# Altium schematic sheet POE+POWER+SERVO+CAMERA.SchDoc
size A
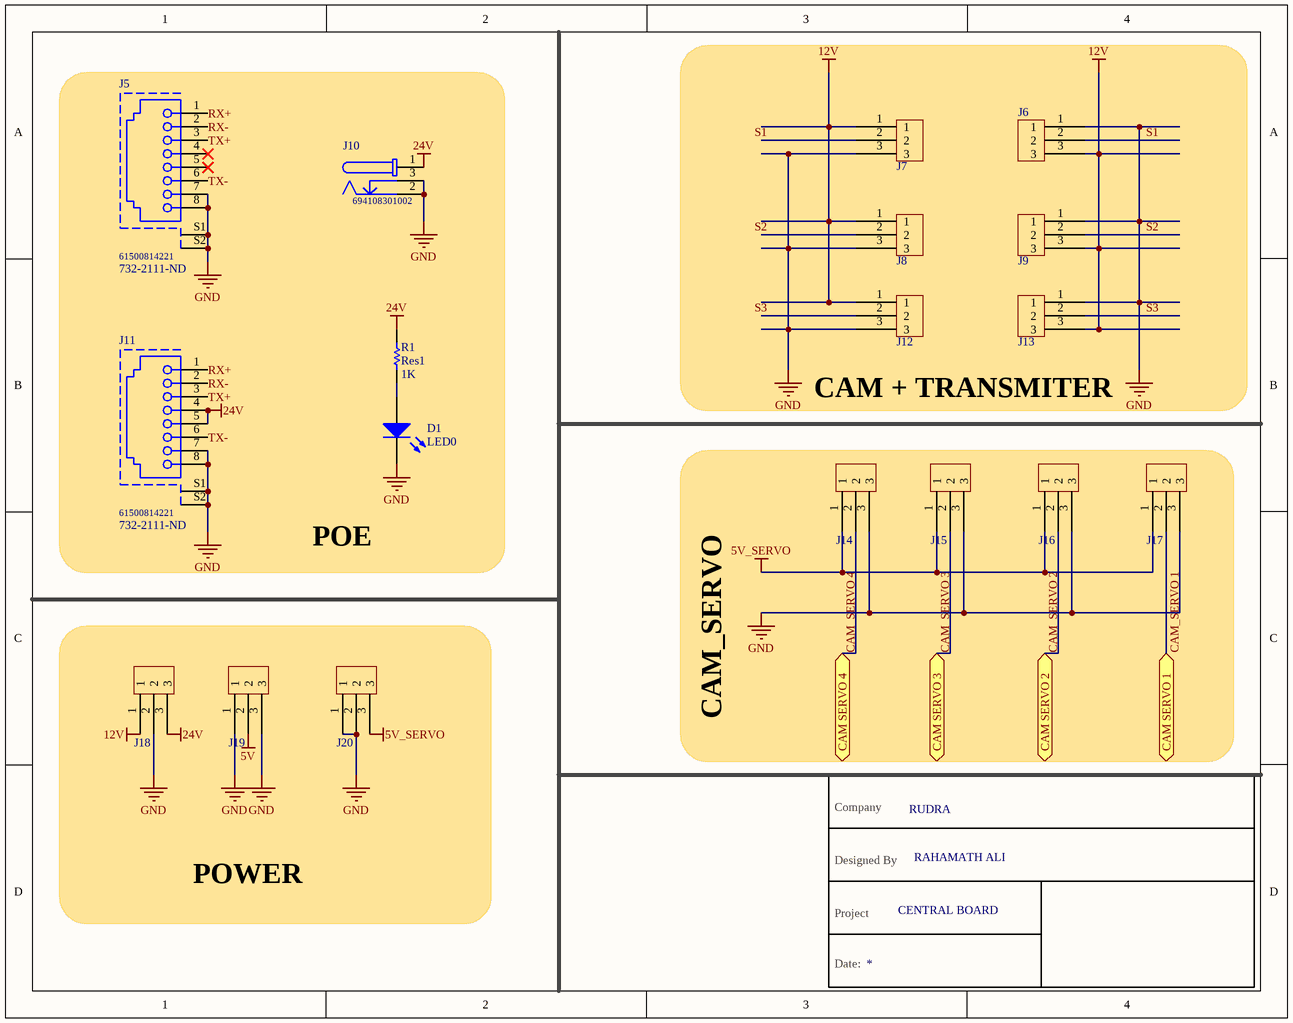
[diagram p0: POE+POWER+SERVO+CAMERA.SchDoc]

## Parts
?  Project: CENTRAL BOARD  Designed By: RAHAMATH ALI  Company: RUDRA  (hidden comment: Schematic Table)  (graphical)
D1  LED0  [LED-0]
J5  61500814221  Supplier Part Number 1: 732-2111-ND  [61500814221]
J6  3 PIN GREEN  [PHOENIX_MSTBA_2,5_3-G-5,08_1757255]  (value not drawn)
J7  3 PIN GREEN  [PHOENIX_MSTBA_2,5_3-G-5,08_1757255]  (value not drawn)
J8  3 PIN GREEN  [PHOENIX_MSTBA_2,5_3-G-5,08_1757255]  (value not drawn)
J9  3 PIN GREEN  [PHOENIX_MSTBA_2,5_3-G-5,08_1757255]  (value not drawn)
J10  694108301002  [694108301002]
J11  61500814221  Supplier Part Number 1: 732-2111-ND  [61500814221]
J12  3 PIN GREEN  [PHOENIX_MSTBA_2,5_3-G-5,08_1757255]  (value not drawn)
J13  3 PIN GREEN  [PHOENIX_MSTBA_2,5_3-G-5,08_1757255]  (value not drawn)
J14  3 PIN GREEN  [PHOENIX_MSTBA_2,5_3-G-5,08_1757255]  (value not drawn)
J15  3 PIN GREEN  [PHOENIX_MSTBA_2,5_3-G-5,08_1757255]  (value not drawn)
J16  3 PIN GREEN  [PHOENIX_MSTBA_2,5_3-G-5,08_1757255]  (value not drawn)
J17  3 PIN GREEN  [PHOENIX_MSTBA_2,5_3-G-5,08_1757255]  (value not drawn)
J18  3 PIN GREEN  [PHOENIX_MSTBA_2,5_3-G-5,08_1757255]  (value not drawn)
J19  3 PIN GREEN  [PHOENIX_MSTBA_2,5_3-G-5,08_1757255]  (value not drawn)
J20  3 PIN GREEN  [PHOENIX_MSTBA_2,5_3-G-5,08_1757255]  (value not drawn)
R1  Res1  value 1K  [AXIAL-0.3]

## Blocks framed on the sheet
POE: D1 J5 J10 J11 R1
CAM + TRANSMITER: J6-J9 J12 J13
CAM_SERVO: J14-J17
POWER: J18-J20

## Ports
CAM SERVO 1 (bidir), CAM SERVO 2 (bidir), CAM SERVO 3 (bidir), CAM SERVO 4 (bidir)

## Nets
5V: J19.2
5V_SERVO: J14.1 J15.1 J16.1 J17.1 J20.3
12V: J6.3 J7.1 J8.1 J9.3 J12.1 J13.3 J18.1
24V: J10.1 J11.4 J11.5 J18.3 R1.2
GND: D1.2(K) J5.7 J5.8 J5.S1 J5.S2 J6.1 J7.3 J8.3 J9.1 J10.2 J10.3 J11.7 J11.8 J11.S1 J11.S2 J12.3 J13.1 J14.3 J15.3 J16.3 J17.3 J18.2 J19.1 J19.3 J20.1 J20.2
CAM_SERVO 1: J17.2 ; port CAM SERVO 1
CAM_SERVO 2: J16.2 ; port CAM SERVO 2
CAM_SERVO 3: J15.2 ; port CAM SERVO 3
CAM_SERVO 4: J14.2 ; port CAM SERVO 4
RX+: J5.1 J11.1
RX-: J5.2 J11.2
S1: J6.2 J7.2
S2: J8.2 J9.2
S3: J12.2 J13.2
TX+: J5.3 J11.3
TX-: J5.6 J11.6
NetD1_1: D1.1(A) R1.1

Not connected (* = marked no-connect by the designer): J5 4* 5*

## Notes on the sheet
- (in symbol Schematic Table) Company; Designed By; Project; Date:

## Library data of the parts
D1 = LED0: Typical INFRARED GaAs LED; Published: 8-Jun-2000; LatestRevisionDate: 08-Jul-2005; LatestRevisionNote: Mech Layer 1 removed.; PackageReference: LED-0; Publisher: Altium Limited; PackageDescription: LED; 2 Leads
J5 J11 = RJ45: Modular Jack WR-MJ, Tab Down, Shielded, Horizontal Entry, THT, 8P8C; Manufacturer: Wurth Elektronik; Manufacturer 1: Wurth Electronics; Withstanding Voltage: 1000VAC; Contact Resistance: 20mOhm; Rated Current: 1.5A; Compliance: Leadfree/RoHS; Port: 1x1; Working Voltage: 120VAC; Connector Type: Jack,RJ45,Socket; Number of Ports: 1; Number of Contacts: 8; Gender: Female; Mating Cycles: 500; Insulation Resistance: 500MR; Voltage Rating (AC): 120V; Entrance: Horizontal; Package Reference: 61500814221; Datasheet URL: https://katalog.we-online.de/em/datasheet/61500814221.pdf; Pin Number: 8P8C; Operating Temperature: -40to85degC; Manufacturer URL: http://www.we-online.de; Packaging: Tray; Publisher: WurthElektronik; Part Number: 61500814221; Mounting Technology: THT; Supplier 1: Digi-Key; Manufacturer Part Number 1: 61500814221; Stock 1: 262; Pricing 1: 1=2.38000, 10=2.33000, 50=2.24000, 100=2.15000, 500=2.06100 (USD); RoHS: Yes; Mount: Through Hole,PCB; Contact Plating: Gold; Contact Material: Copper Alloy,Copper; Housing Material: PBT; Color: Black; Min Operating Temperature: -40°C; Max Operating Temperature: 85°C; Termination: Through Hole; Shielding: Shielded; Number of Positions: 8; Package Quantity: 80; Number of Rows: 1; Direction: Down; Orientation: Right Angle; Current Rating: 1.5A; Length: 13.65mm; Height: 19.95mm; Depth: 21.2mm; Width: 15.88mm; REACH SVHC: Unknown; Flammability Rating: UL94 V-0; ComponentLink1URL: https://datasheet.ciiva.com/1108/76605-1108145.pdf?src-supplier=Element14; ComponentLink1Description: https://datasheet.ciiva.com/1108/76605-1108145.pdf?src-supplier=Element14; ComponentLink2URL: https://datasheet.ciiva.com/4561/61500814221-78459-4561634.pdf?src-supplier=Mouser; ComponentLink2Description: https://datasheet.ciiva.com/4561/61500814221-78459-4561634.pdf?src-supplier=Mouser; ComponentLink3URL: https://datasheet.ciiva.com/686/61500814221-686710.pdf?src-supplier=Digi-Key; ComponentLink3Description: https://datasheet.ciiva.com/686/61500814221-686710.pdf?src-supplier=Digi-Key; ComponentLink4URL: https://datasheet.ciiva.com/11726/0900766b80f88678-11726201.pdf?src-supplier=RSComponents; ComponentLink4Description: https://datasheet.ciiva.com/11726/0900766b80f88678-11726201.pdf?src-supplier=RSComponents; ComponentLink5URL: https://datasheet.ciiva.com/48689/001088220-da-01-en-wr-com-modular-jack-61500814221-48689546.pdf?src-supplier=Conrad; ComponentLink5Description: https://datasheet.ciiva.com/48689/001088220-da-01-en-wr-com-modular-jack-61500814221-48689546.pdf?src-supplier=Conrad
J6-J9 J12-J20 = 3 PIN GREEN: Manufacturer 1: Phoenix Contact; Manufacturer Part Number 1: 1757255; Current Rating: 12A; Voltage Rating: 250V; Voltage Rating (DC): 320V; Number of Poles: 3; Number of Levels: 1; Current: 15A; Voltage: 300V; Connector Type: Plug; Gender: Male; Pitch: 5.08mm; Approvals: UL,CSA,VDE,EN; Supplier 1: Digi-Key; Stock 1: 4025; Pricing 1: 1=1.03000, 10=0.99000, 50=0.94720, 100=0.92130, 250=0.86100, 500=0.79212, 1000=0.73185, 2500=0.69741, 5000=0.65436 (USD); RoHS: Yes; Mount: Through Hole; Weight: 5.396916oz; Color: Grey,Green; Contact Plating: Tin; Housing Color: Green; Housing Material: Polybutylene; Contact Material: Tin; Package Quantity: 50; Packaging: Bulk; Termination: Solder; Max Current Rating: 12A; Number of Rows: 1; Number of Positions: 3; Number of Positions Per Level: 3; Number of Contacts: 3; Orientation: Right Angle; Length: 17.24mm; Height: 12.1mm; Depth: 12mm; Width: 17.16mm; Lead Free: Lead Free; Flammability Rating: UL94 V-0; REACH SVHC: No SVHC; ComponentLink1URL: https://datasheet.ciiva.com/15197/getdatasheetpartid-176351-15197329.pdf?src-supplier=Verical; ComponentLink1Description: https://datasheet.ciiva.com/15197/getdatasheetpartid-176351-15197329.pdf?src-supplier=Verical; ComponentLink2URL: https://datasheet.ciiva.com/16096/1757255-16096404.pdf?src-supplier=Onlinecomponents.com; ComponentLink2Description: https://datasheet.ciiva.com/16096/1757255-16096404.pdf?src-supplier=Onlinecomponents.com; ComponentLink3URL: https://datasheet.ciiva.com/7630/1697152-7630840.pdf?src-supplier=Element14; ComponentLink3Description: https://datasheet.ciiva.com/7630/1697152-7630840.pdf?src-supplier=Element14; ComponentLink4URL: https://datasheet.ciiva.com/795/1757255-795421.pdf?src-supplier=Digi-Key; ComponentLink4Description: https://datasheet.ciiva.com/795/1757255-795421.pdf?src-supplier=Digi-Key; ComponentLink5URL: https://datasheet.ciiva.com/29210/569707-da-01-en-grundgehaeuse-1757255-250-st-29210878.pdf?src-supplier=Conrad; ComponentLink5Description: https://datasheet.ciiva.com/29210/569707-da-01-en-grundgehaeuse-1757255-250-st-29210878.pdf?src-supplier=Conrad; Supplier Part Number 1: 277-1107-ND
J10 = DC POWER JACK: DC Power Jack Connector WR-DC, Male, Right Angled, THT, 5 A, 24 V; Manufacturer: Wurth Elektronik; Rated Current: 5A; Plug Inner Diameter: 2.55mm; Plug Outer Diameter: 5.5mm; Working Voltage: 24V; Opening Diameter: 6.4mm; Publisher: WurthElektronik; Orientation: RightAngled; Part Number: 694108301002; Manufacturer URL: http://www.we-online.de; Mounting Technology: THT; Packaging: Bag; Datasheet URL: http://katalog.we-online.de/em/datasheet/6941xx301002.pdf; Operating Temperature: -40to85degC; Package Reference: 694108301002; Gender: Male
R1 = Res1: Resistor; Published: 8-Jun-2000; LatestRevisionDate: 17-Jul-2002; LatestRevisionNote: Re-released for DXP Platform.; PackageReference: AXIAL-0.3; Publisher: Altium Limited; PackageDescription: Axial Device, Thru-Hole; 2 Leads; 0.3 in Pin Spacing